# EAGLE design ライン_前 (EAGLE 9.6.2)

## Sheet 1 of 2

## Sheet 2 of 2
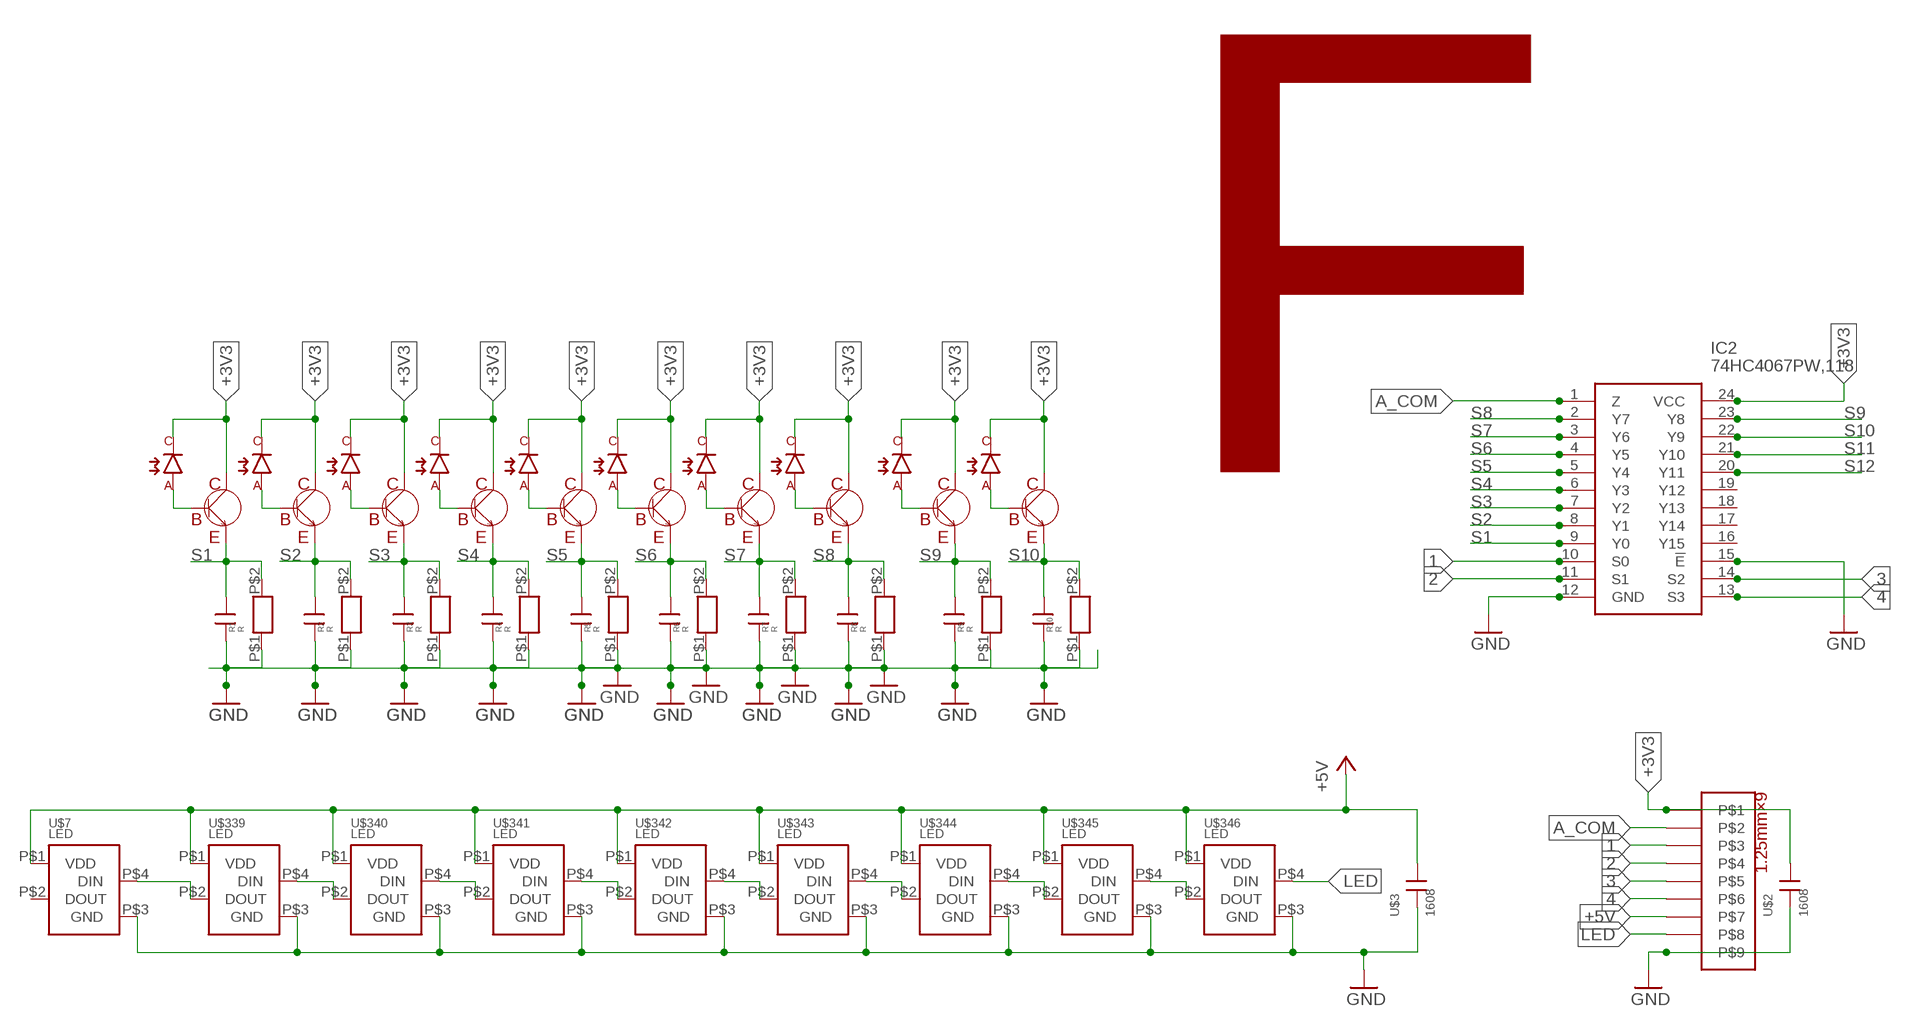
[diagram p0: schematic, sheet 2]

### Parts
C1  1608  [CON]
C2  1608  [CON]
C3  1608  [CON]
C4  1608  [CON]
C5  1608  [CON]
C6  1608  [CON]
C7  1608  [CON]
C8  1608  [CON]
C9  1608  [CON]
C10  1608  [CON]
IC2  74HC4067PW,118  [SOP65P640X110-24N]
R1  R  [1608]
R2  R  [1608]
R3  R  [1608]
R4  R  [1608]
R5  R  [1608]
R6  R  [1608]
R7  R  [1608]
R8  R  [1608]
R9  R  [1608]
R10  R  [1608]
U$1  1MMCON  [1MMCON]
U$2  1608  [CON]
U$3  1608  [CON]
U$7  LED  [LED]
U$17  2CS2712  [TRANS_SSM3J325F,LF]
U$18  フォトダイオード  [フォトダイオード]
U$19  2CS2712  [TRANS_SSM3J325F,LF]
U$20  フォトダイオード  [フォトダイオード]
U$21  2CS2712  [TRANS_SSM3J325F,LF]
U$22  フォトダイオード  [フォトダイオード]
U$23  2CS2712  [TRANS_SSM3J325F,LF]
U$24  フォトダイオード  [フォトダイオード]
U$25  2CS2712  [TRANS_SSM3J325F,LF]
U$26  フォトダイオード  [フォトダイオード]
U$27  2CS2712  [TRANS_SSM3J325F,LF]
U$28  フォトダイオード  [フォトダイオード]
U$29  2CS2712  [TRANS_SSM3J325F,LF]
U$30  フォトダイオード  [フォトダイオード]
U$31  2CS2712  [TRANS_SSM3J325F,LF]
U$32  フォトダイオード  [フォトダイオード]
U$53  2CS2712  [TRANS_SSM3J325F,LF]
U$54  フォトダイオード  [フォトダイオード]
U$55  2CS2712  [TRANS_SSM3J325F,LF]
U$56  フォトダイオード  [フォトダイオード]
U$339  LED  [LED]
U$340  LED  [LED]
U$341  LED  [LED]
U$342  LED  [LED]
U$343  LED  [LED]
U$344  LED  [LED]
U$345  LED  [LED]
U$346  LED  [LED]

### Nets
1: IC2.10(S0) U$1.P$3
2: IC2.11(S1) U$1.P$4
3: IC2.14(S2) U$1.P$5
4: IC2.13(S3) U$1.P$6
+3V3 [New Class]: IC2.24(VCC) U$1.P$1 U$2.P$1 U$17.C U$18.C U$19.C U$20.C U$21.C U$22.C U$23.C U$24.C U$25.C U$26.C U$27.C U$28.C U$29.C U$30.C U$31.C U$32.C U$53.C U$54.C U$55.C U$56.C
+5V [New Class]: U$1.P$7 U$3.P$1 U$7.P$1(VDD) U$339.P$1(VDD) U$340.P$1(VDD) U$341.P$1(VDD) U$342.P$1(VDD) U$343.P$1(VDD) U$344.P$1(VDD) U$345.P$1(VDD) U$346.P$1(VDD)
A_COM: IC2.1(Z) U$1.P$2
GND [New Class]: C1.P$2 C2.P$2 C3.P$2 C4.P$2 C5.P$2 C6.P$2 C7.P$2 C8.P$2 C9.P$2 C10.P$2 IC2.12(GND) IC2.15(!E) R1.P$1 R2.P$1 R3.P$1 R4.P$1 R5.P$1 R6.P$1 R7.P$1 R8.P$1 R9.P$1 R10.P$1 U$1.P$9 U$2.P$2 U$3.P$2 U$7.P$3(GND) U$339.P$3(GND) U$340.P$3(GND) U$341.P$3(GND) U$342.P$3(GND) U$343.P$3(GND) U$344.P$3(GND) U$345.P$3(GND) U$346.P$3(GND)
LED: U$1.P$8 U$346.P$4(DIN)
N$5: U$7.P$4(DIN) U$339.P$2(DOUT)
N$16: U$17.B U$18.A
N$17: U$19.B U$20.A
N$18: U$21.B U$22.A
N$19: U$23.B U$24.A
N$20: U$25.B U$26.A
N$21: U$27.B U$28.A
N$22: U$29.B U$30.A
N$33: U$31.B U$32.A
N$34: U$53.B U$54.A
N$35: U$55.B U$56.A
N$139: U$339.P$4(DIN) U$340.P$2(DOUT)
N$140: U$340.P$4(DIN) U$341.P$2(DOUT)
N$141: U$343.P$4(DIN) U$344.P$2(DOUT)
N$142: U$344.P$4(DIN) U$345.P$2(DOUT)
N$143: U$345.P$4(DIN) U$346.P$2(DOUT)
N$144: U$341.P$4(DIN) U$342.P$2(DOUT)
N$145: U$342.P$4(DIN) U$343.P$2(DOUT)
S1: C1.P$1 IC2.9(Y0) R1.P$2 U$17.E
S2: C2.P$1 IC2.8(Y1) R2.P$2 U$19.E
S3: C3.P$1 IC2.7(Y2) R3.P$2 U$21.E
S4: C4.P$1 IC2.6(Y3) R4.P$2 U$23.E
S5: C5.P$1 IC2.5(Y4) R5.P$2 U$25.E
S6: C6.P$1 IC2.4(Y5) R6.P$2 U$27.E
S7: C7.P$1 IC2.3(Y6) R7.P$2 U$29.E
S8: C8.P$1 IC2.2(Y7) R8.P$2 U$31.E
S9: C9.P$1 IC2.23(Y8) R9.P$2 U$53.E
S10: C10.P$1 IC2.22(Y9) R10.P$2 U$55.E
S11: IC2.21(Y10)
S12: IC2.20(Y11)
Unconnected: IC2.16(Y15) IC2.17(Y14) IC2.18(Y13) IC2.19(Y12) U$7.P$2(DOUT)

### Notes on the sheet
- F

## Library data of the parts
C1-C10 U$2 U$3 = con1608:1608
IC2 = 16ch MUX:74HC4067PW,118: 74HC(T)4067 - 16-channel analog multiplexer/demultiplexer@en-us Source: Datasheet <https://assets.nexperia.com/documents/data-sheet/74HC_HCT4067.pdf>; DESCRIPTION: 74HC(T)4067 - 16-channel analog multiplexer/demultiplexer@en-us; HEIGHT: 1.1mm; MANUFACTURER_NAME: Nexperia; MANUFACTURER_PART_NUMBER: 74HC4067PW,118; MOUSER_PART_NUMBER: 771-74HC4067PW-T; MOUSER_PRICE-STOCK: https://www.mouser.co.uk/ProductDetail/Nexperia/74HC4067PW118?qs=P62ublwmbi9BArRi%252BuDUjA%3D%3D
R1-R10 = R 1608:R
U$1 = 9P_1.25mmCON:1MMCON
U$7 U$339-U$346 = フルカラーLED:LED
U$17 U$19 U$21 U$23 U$25 U$27 U$29 U$31 U$53 U$55 = 2CS2712:2CS2712
U$18 U$20 U$22 U$24 U$26 U$28 U$30 U$32 U$54 U$56 = フォトダイオード:フォトダイオード

## Net classes
1 New Class: width 0.254 mm

## Board
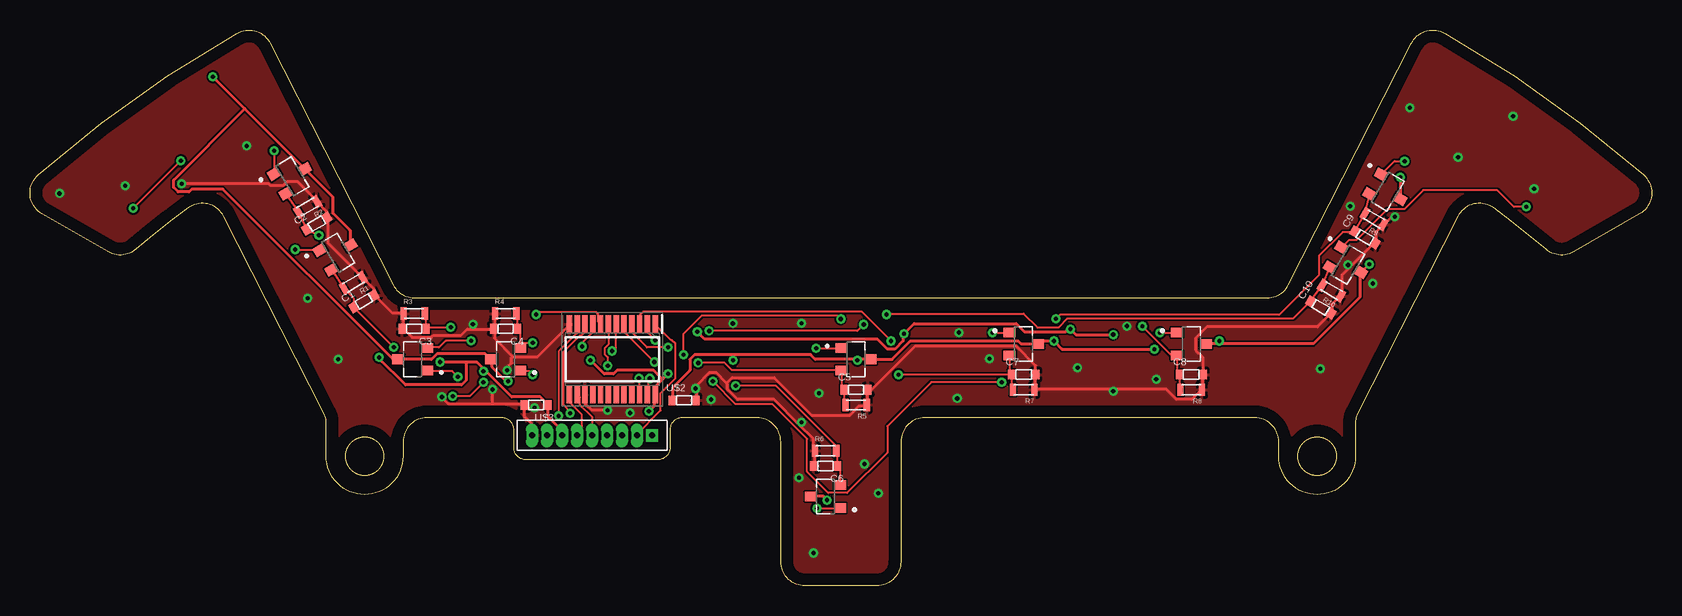
[diagram p1: board, top side]
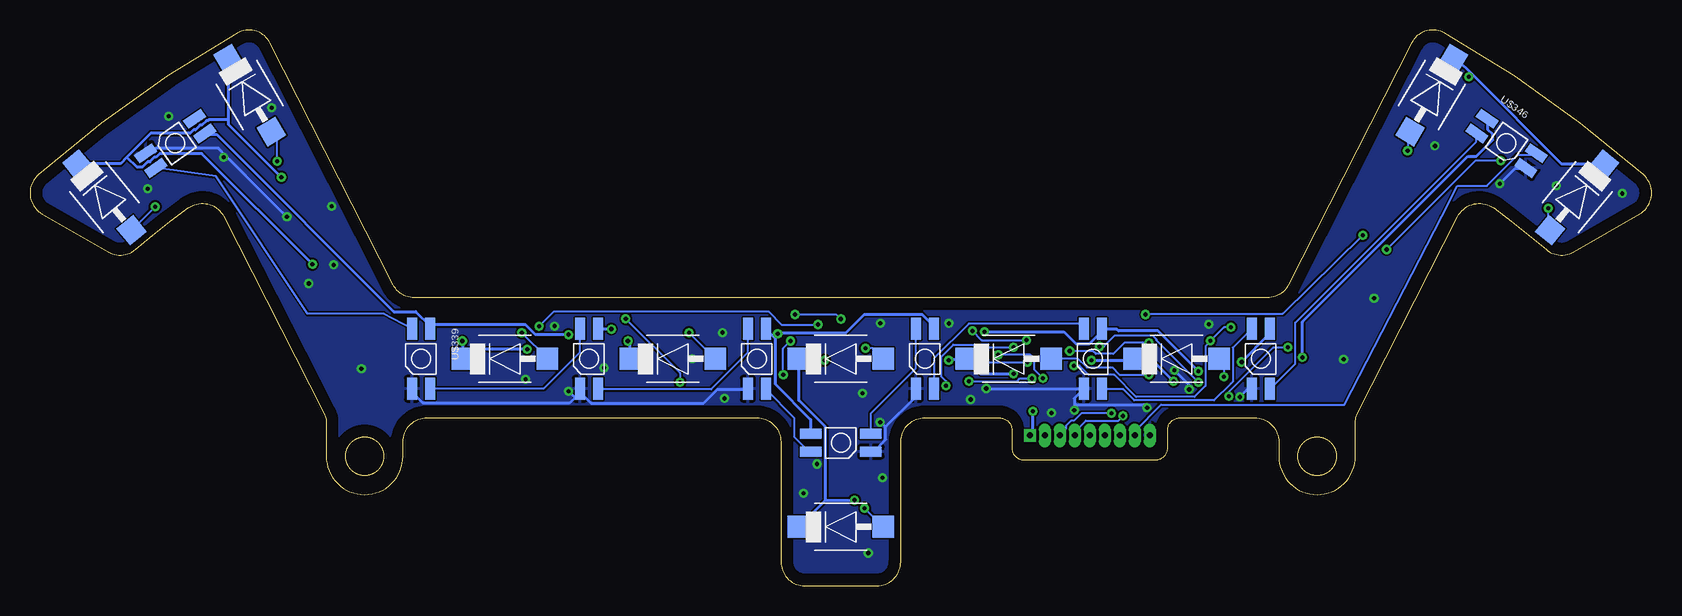
[diagram p2: board, bottom side, seen from below]

Size 135.18 x 46.32 mm. Coordinates in mm from the lower left corner, seen from the top.
Outline: 104.92,25.09 115.16,45.22 arc-93 117.93,46.05 arc-12 134.5,34.24 arc-109 134.18,31.01 128.67,27.83 arc-70 126.39,28.02 arc4 122,31.48 arc100 119.03,30.78 110.67,14.34 arc27 110.49,13.62 110.49,10.8 arc-180 104.09,10.8 104.09,12 arc90 102.09,14 74.59,14 arc90 72.59,12 72.59,2 arc-90 70.59,0 64.59,0 arc-90 62.59,2 62.59,12 arc90 60.59,14 54.34,14 arc90 53.34,13 53.34,11.5 arc-90 52.34,10.5 41.34,10.5 arc-90 40.34,11.5 40.34,13 arc90 39.34,14 33.09,14 arc90 31.09,12 31.09,10.8 arc-180 24.69,10.8 24.69,13.62 arc27 24.52,14.34 16.15,30.78 arc100 13.18,31.48 arc4 8.79,28.02 arc-70 6.51,27.83 1,31.01 arc-109 0.68,34.24 arc-12 17.25,46.05 arc-93 20.03,45.22 30.27,25.09 arc63 32.05,24 103.13,24 arc63 104.92,25.09
Outline: circle at 27.89,10.8 radius 1.6
Outline: circle at 107.29,10.8 radius 1.6
Copper layers (1*16): Top 0.035mm / dielectric 1.5mm / Bottom 0.035mm
Design rules "default": minimum track width 6mil, minimum drill 0.35mm, track to track 6mil, track to pad 6mil, pad to pad 6mil, via to via 6mil, smd to smd 6mil, copper to edge 40mil, drill to drill 6mil, minimum pad ring 10mil, minimum via ring 8mil, stop-mask expansion 4mil, vias tented up to drill 0mil, thermal gap 10mil

### Footprints (pad centres in the part's own frame; a part is rotated, then mirrored left to right if it is on the bottom)
CON = smd 0.6 x 0.813: P$1 -1,0; P$2 1,0
SOP65P640X110-24N = smd 1.475 x 0.45: 1 -2.938,3.575; 2 -2.938,2.925; 3 -2.938,2.275; 4 -2.938,1.625; 5 -2.938,0.975; 6 -2.938,0.325; 7 -2.938,-0.325; 8 -2.938,-0.975; 9 -2.938,-1.625; 10 -2.938,-2.275; 11 -2.938,-2.925; 12 -2.938,-3.575; 13 2.938,-3.575; 14 2.938,-2.925; 15 2.938,-2.275; 16 2.938,-1.625; 17 2.938,-0.975; 18 2.938,-0.325; 19 2.938,0.325; 20 2.938,0.975; 21 2.938,1.625; 22 2.938,2.275; 23 2.938,2.925; 24 2.938,3.575
1608 = smd 0.508 x 1.016: P$1 -0.889,0; P$2 0.889,0
1MMCON = drill 0.5 square: P$1 0,0 | drill 0.5 long: P$2 1.25,0; P$3 2.5,0; P$4 3.75,0; P$5 5,0; P$6 6.25,0; P$7 7.5,0; P$8 8.75,0; P$9 10,0
LED = smd 1.8 x 0.82: P$1 -2.5,0.75; P$2 -2.5,-0.75; P$3 2.5,-0.75; P$4 2.5,0.75
TRANS_SSM3J325F,LF = smd 1 x 0.8: B -1.2,0.95; C 1.2,0; E -1.2,-0.95
フォトダイオード = smd 1.8 x 1.8: A -3.55,0; C 3.55,0

### Placement (x,y rotation side)
C1  27.84,23.7 30.7 top
C2  23.9,30.18 30.7 top
C3  32.03,21.42 180 top
C4  39.65,21.42 180 top
C5  68.86,16.34 0 top
C6  66.32,9.99 180 top
C7  82.83,17.61 0 top
C8  96.8,17.61 0 top
C9  111.28,29.04 329.3 top
C10  107.6,23.2 329.3 top
IC2  48.54,18.88 270 top
R1  26.95,25.23 210.7 top
R2  23.14,31.58 210.7 top
R3  32.03,22.69 0 top
R4  39.65,22.69 0 top
R5  68.86,15.07 180 top
R6  66.32,11.26 0 top
R7  82.83,16.34 180 top
R8  96.8,16.34 180 top
R9  112.04,30.56 149.3 top
R10  108.49,24.59 149.3 top
U$1  51.84,12.53 180 top
U$2  54.51,15.45 0 top
U$3  42.19,15.07 180 top
U$7  123.08,36.87 215.1 bottom
U$17  25.68,27.77 30.7 top
U$18  6.21,32.38 50.5 bottom
U$19  21.87,34.12 30.7 top
U$20  18.32,40.89 59.3 bottom
U$21  31.89,18.88 180 top
U$22  39.59,18.92 180 bottom
U$23  39.65,18.88 180 top
U$24  53.59,18.92 180 bottom
U$25  68.86,18.88 0 top
U$26  67.59,18.92 180 bottom
U$27  66.32,7.45 180 top
U$28  67.59,4.92 180 bottom
U$29  82.83,20.15 0 top
U$30  81.59,18.92 180 bottom
U$31  96.8,20.15 0 top
U$32  95.59,18.92 180 bottom
U$53  113.18,32.85 329.3 top
U$54  116.86,40.89 120.7 bottom
U$55  109.88,26.75 329.3 top
U$56  128.97,32.38 129.5 bottom
U$339  102.59,18.92 270 bottom
U$340  88.59,18.92 270 bottom
U$341  74.59,18.92 270 bottom
U$342  67.59,11.92 0 bottom
U$343  60.59,18.92 270 bottom
U$344  46.59,18.92 270 bottom
U$345  32.59,18.92 270 bottom
U$346  12.1,36.87 324.9 bottom

### Tracks (layer width: path | path; a pad name or v marks a point on that pad's centre or on a via)
1  (via drill 0.35)
  Top 0.152: v45.03,14.38 45.03,14.51 44.43,15.12 44.43,19.46 45.81,20.85 45.94,20.85 46.25,21.17 46.27,21.18 IC2.10
  Bottom 0.152: U$1.P$3 49.38,12.55 48.83,13.11 48.83,13.33 48.4,13.76 48.15,13.76 47.53,14.38 v45.03,14.38
2  (via drill 0.35)
  Top 0.152: v44.07,14.15 44.12,14.2 44.12,19.59 45.57,21.04 45.57,21.77 IC2.11
  Bottom 0.152: v44.07,14.15 44.45,13.77 47.17,13.77 48.08,12.86 48.08,12.55 U$1.P$4
3
  Top 0.152: IC2.14 45.81,15.74 45.81,15.11 46.84,14.08 U$1.P$5
4
  Top 0.152: IC2.13 45.04,15.87 45.04,15.23 45.97,14.3 45.97,12.91 U$1.P$6
+3V3  (via drill 0.35)
  Top 0.254: U$17.C 26.67,28.4 26.67,29.62 25.22,31.07 25.22,32.44 22.94,34.73 U$19.C 22.86,34.8 17.91,39.76 | v15.24,42.42 17.91,39.76 | v114.23,34.04 114.23,32.29 U$53.C | U$27.C 66.14,7.45 v66.45,7.14 | 99.14,20.17 106.99,20.17 110.87,24.06 110.87,26.12 U$55.C 111.03,26.19 v111.64,26.8 | 99.14,20.17 98.07,20.17 U$31.C | 99.14,20.17 v99.14,20.4 | v39.85,17.05 39.7,17.05 38.48,18.27 38.48,18.8 U$23.C 38.41,18.88 37.95,19.33 33.92,19.33 33.47,18.88 U$21.C 30.25,18.88 16.08,33.05 13.49,33.05 13.26,32.82 12.35,32.82 11.97,33.2 11.97,33.81 17.91,39.76 | v51.59,14.53 52.05,14.99 52.05,15.91 IC2.24 52.12,16.06 52.12,16.59 52.73,17.2 | 58.6,19.26 65.08,19.26 65.46,18.88 68.96,18.88 | 58.6,19.26 55.4,19.26 55.02,18.88 55.02,17.96 53.57,16.52 53.57,15.45 U$2.P$1 | 68.96,18.88 U$25.C 71.86,18.88 73.38,20.4 82.37,20.4 82.6,20.17 83.97,20.17 U$29.C 84.13,20.17 84.36,20.4 v85.35,20.4 86.03,19.72 v93.73,19.72 | 58.6,19.26 v58.6,18.8 | v53.19,17.66 52.73,17.2 | v46.71,18.8 47.86,17.66 48.64,17.66 48.95,17.96 51.97,17.96 52.73,17.2 | v68.96,18.8 68.96,18.88
  Bottom 0.254: 15.01,42.65 16.23,43.87 16.46,43.87 U$20.C | 15.01,42.65 7.55,35.18 3.96,35.18 U$18.C | 15.01,42.65 v15.24,42.42 | v114.23,34.04 118.65,38.46 118.65,38.84 | 118.65,38.84 118.65,43.87 U$54.C | 127.1,35.72 125.12,37.7 121.85,37.7 121.54,38 121.39,38 121.01,38.38 120.86,38.38 120.47,38.77 120.32,38.77 120.25,38.84 118.65,38.84 | 127.1,35.72 127.64,35.18 131.22,35.18 U$56.C | 68.89,7.14 v66.45,7.14 | 68.89,7.14 71.1,4.93 U$28.C | 68.89,7.14 68.89,13.24 71.1,15.45 71.1,18.88 U$26.C 71.02,18.8 v68.96,18.8 | v99.14,20.4 99.14,18.95 U$32.C 99.06,19.72 v93.73,19.72 | v39.85,17.05 41.68,18.88 43.13,18.88 U$22.C 43.21,18.8 v46.71,18.8 | v51.59,14.53 51.59,12.78 U$1.P$1 | v58.6,18.8 58.52,18.88 57.15,18.88 U$24.C 57.08,18.8 55.93,17.66 v53.19,17.66 | v85.35,20.4 85.19,20.25 85.19,18.95 U$30.C | 127.1,35.72 126.27,34.88 125.81,34.88 125.35,35.34 125.2,35.34 124.82,35.72 124.67,35.72 124.36,36.02 120.86,36.02 v111.64,26.8
+5V  (via drill 0.35)
  Top 0.254: U$1.P$7 44.27,12.55 44.27,13.01 43.21,14.08 43.21,15.07 U$3.P$1 43.13,15.14 42.52,15.75 40.16,15.75 37.87,18.04 | 36.35,18.65 37.26,18.65 37.87,18.04 | 36.35,18.65 v34.19,18.65 | v37.8,17.89 37.8,17.96 37.87,18.04 | v29.11,19.03 29.11,18.94 31.31,16.74 35.97,16.74 36.35,17.12 36.35,18.65 | v90.3,20.93 87.17,20.93 v86.72,21.39 86.54,21.39 86.34,21.19 82.88,21.19 82.22,21.85 73.69,21.85 v72.85,21.01 72.77,20.93 72.77,20.4 72.09,19.72 71.48,19.72 70.64,20.55 56.24,20.55 v55.63,21.16
  Bottom 0.254: v34.19,18.65 31.85,20.99 31.85,21.39 U$345.P$1 | v37.8,17.89 41.15,21.24 44.43,21.24 44.58,21.39 45.8,21.39 U$344.P$1 45.87,21.32 45.87,21.16 46.87,20.17 48.01,20.17 49,21.16 v55.63,21.16 | v29.11,19.03 29.11,22 15.32,35.79 14.63,35.79 13.26,37.17 13.26,37.62 13.64,38 13.64,38.92 U$346.P$1 | U$7.P$1 120.55,37.62 119.64,37.62 104.85,22.84 103.02,22.84 101.88,21.7 101.88,21.47 U$339.P$1 101.81,21.77 93.88,21.77 93.04,20.93 v90.3,20.93 | 73.08,20.63 73.08,16.82 70.11,13.85 70.11,12.71 U$342.P$1 | 73.08,20.63 73.84,21.39 U$341.P$1 | 73.08,20.63 72.77,20.93 | 72.77,20.93 72.62,21.09 67.16,21.09 65.64,22.61 60.81,22.61 59.9,21.7 59.9,21.47 U$343.P$1 | v86.72,21.39 87.78,21.39 U$340.P$1 | v72.85,21.01 72.77,20.93
A_COM
  Top 0.152: IC2.1 52.12,21.77 53.42,20.48 53.49,20.48 53.8,20.17 53.8,17.28 52.58,16.06 52.58,14.61 50.52,12.55 U$1.P$2
GND  (via drill 0.35)
  Top 0.254: C4.P$2 38.71,21.47 38.71,22.69 R4.P$1 | C4.P$2 38.56,21.39 36.45,21.39 35.92,20.86 33.61,20.86 33.45,20.71 31.85,20.71 31.17,21.39 C3.P$2 31.09,21.47 31.09,22.69 R3.P$1 31.02,22.76 30.18,22.76 28.81,24.14 C1.P$2 28.65,24.29 28.65,24.74 27.74,25.66 R1.P$1 27.66,25.74 24.84,28.55 24.84,30.61 C2.P$2 24.69,30.76 24.69,31.22 23.93,31.98 R2.P$1 23.85,32.14 22.33,33.66 21.41,33.66 21.11,33.36 20.04,33.36 19.89,33.51 v12.65,33.51 | 40.24,19.11 42.29,19.11 44.96,21.77 IC2.12 | 40.24,19.11 38.71,20.63 38.71,21.32 C4.P$2 | v48.14,14.64 46.84,14.64 46.33,15.14 46.33,15.91 IC2.15 | U$3.P$2 41.23,15.07 41.23,14.08 41.84,13.47 41.84,12.55 U$1.P$9 | v34.33,15.74 34.33,15.72 34.9,15.14 38.56,15.14 | 38.56,15.14 41.15,15.14 U$3.P$2 | v42.06,14.84 41.3,14.84 U$3.P$2 | C6.P$2 65.38,10.04 65.38,11.26 R6.P$1 65.31,11.33 65.31,12.25 64.12,13.43 | 55.55,16.44 55.55,16.67 56.62,17.73 57.23,17.73 58.07,16.9 | 55.55,16.44 55.55,15.45 U$2.P$2 | 58.07,16.9 58.14,16.82 58.14,16.36 58.98,15.52 62.03,15.52 64.12,13.43 | 58.07,16.9 58.52,17.35 62.03,17.35 65.15,14.23 68.35,14.23 69.12,14.99 69.65,14.99 R5.P$1 69.8,15.07 69.8,16.29 C5.P$2 69.95,16.36 70.18,16.36 73.76,19.94 82.22,19.94 83.82,18.34 83.82,17.73 C7.P$2 83.82,17.58 83.82,16.44 R7.P$1 83.9,16.36 90.3,16.36 | 64.12,13.43 v64.31,13.62 | v55.48,16.44 55.55,16.44 | 90.3,16.36 94.72,16.36 95.56,15.52 96.85,15.52 97.61,16.29 R8.P$1 97.69,16.36 97.77,16.44 97.77,17.58 C8.P$2 97.77,17.73 97.77,19.03 97.16,19.64 97.16,20.63 98.1,21.57 107.32,21.57 108.36,22.61 C10.P$2 108.51,22.69 108.51,23.45 109.2,24.14 R10.P$1 109.35,24.21 109.35,25.89 112.02,28.55 C9.P$2 112.17,28.55 112.17,29.47 112.78,30.08 R9.P$1 112.93,30.16 113.54,30.76 v113.77,30.76
  Top 0.254: v90.3,16.21 90.3,16.36 | v39.78,17.96 39.78,18.19 40.16,18.57 40.16,19.03 40.24,19.11 | 38.56,15.14 v38.56,16.36
  Bottom 0.254: v12.65,33.51 11.36,34.8 10.52,34.8 U$346.P$3 | v34.33,15.74 33.71,16.36 33.38,16.36 U$345.P$3 | v42.06,14.84 42.32,15.09 47.98,15.09 v48.14,14.64 48.14,15.62 U$344.P$3 47.4,16.44 v55.48,16.44 | 63.86,13.24 61.34,15.75 61.34,16.36 U$343.P$3 | 63.86,13.24 63.86,12.17 64.85,11.18 65.08,11.18 U$342.P$3 | 63.86,13.24 64.24,13.62 v64.31,13.62 | U$341.P$3 75.36,16.36 77.88,16.36 79.02,15.22 88.39,15.22 89.31,16.13 89.31,16.36 U$340.P$3 89.38,16.06 89.77,15.68 | 89.77,15.68 90.22,15.22 102.41,15.22 103.33,16.13 103.33,16.36 U$339.P$3 | v113.77,30.76 119.48,36.48 124.67,36.48 125.05,36.1 125.5,36.1 U$7.P$3 | v90.3,16.21 89.77,15.68 | v39.78,17.96 38.56,16.74 v38.56,16.36
  other vias: 25.68,18.88 23.14,23.96 18.06,36.66 2.47,32.7 7.94,33.33 36.92,21.79 50.03,14.41 56.77,15.52 65.78,16.05 58.59,21.86 64.3,21.89 77.45,21.1 79.99,18.92 77.29,15.61 64.11,9.01 69.57,10.15 70.72,7.71 65.31,2.74 91.44,21.65 93.88,17.21 87.33,18.18 107.56,18.09 111.94,25.19 119.04,35.71 109.87,26.74 123.62,39.13 125.38,33.08 115.03,39.83 110.05,31.64
  pour Top: -0.99,46.82 -0.99,-2.71 141.25,-2.71 141.25,48.09 -0.99,48.09
  pour Bottom: -0.99,48.09 -0.99,-2.71 141.25,-2.71 141.25,48.09
LED
  Bottom 0.152: U$1.P$8 43.09,12.9 40.9,15.09 25.64,15.09 17.51,30.78 16.19,33.33 13.74,33.33 11.15,35.91 9.76,35.91 U$346.P$4
N$5
  Bottom 0.152: U$339.P$2 105.69,22.69 112.04,22.69 119.66,34.12 U$7.P$4
N$16  (via drill 0.35)
  Top 0.152: v22.1,28.02 24.16,28.02 U$17.B | v8.61,31.45 v12.58,35.41
  Bottom 0.152: v22.1,28.02 14.71,35.41 v12.58,35.41 | v8.61,31.45 8.61,29.77 8.54,29.7 U$18.A
N$17  (via drill 0.35)
  Top 0.152: v20.35,36.25 20.35,34.35 U$19.B
  Bottom 0.152: v20.35,36.25 20.35,37.62 20.2,37.78 U$20.A
N$18  (via drill 0.35)
  Top 0.152: v35.66,17.43 35.21,17.89 33.16,17.89 U$21.B
  Bottom 0.152: v35.66,17.43 35.66,18.57 35.97,18.88 U$22.A
N$19  (via drill 0.35)
  Top 0.152: v41.91,17.58 41.61,17.89 40.92,17.89 U$23.B
  Bottom 0.152: v41.91,17.58 44.35,17.58 44.96,18.19 47.09,18.19 47.86,18.95 49.99,18.95 U$24.A
N$20  (via drill 0.35)
  Top 0.152: v65.53,19.79 67.59,19.79 U$25.B
  Bottom 0.152: v65.53,19.79 64.92,19.79 64.09,18.95 U$26.A
N$21  (via drill 0.35)
  Top 0.152: v65.61,6.46 67.52,6.46 U$27.B
  Bottom 0.152: v65.61,6.46 64.09,4.93 U$28.A
N$22  (via drill 0.35)
  Top 0.152: v80.24,21.09 81.61,21.09 U$29.B
  Bottom 0.152: v80.24,21.09 78.11,18.95 U$30.A
N$33  (via drill 0.35)
  Top 0.152: v94.19,21.09 95.56,21.09 U$31.B
  Bottom 0.152: v94.19,21.09 92.05,18.95 U$32.A
N$34  (via drill 0.35)
  Top 0.152: U$53.B 113.75,35.39 v114.58,35.39
  Bottom 0.152: v114.58,35.39 114.58,37.38 U$54.A
N$35  (via drill 0.35)
  Top 0.152: v124.74,31.58 123.7,31.58 122.3,32.98 116.13,32.98 114.54,31.39 113.16,31.39 110.57,28.8 109.96,28.8 U$55.B
  Bottom 0.152: U$56.A v124.74,31.58
N$139
  Bottom 0.152: U$339.P$4 101.81,16.44 92.36,16.44 89.38,19.41 89.38,21.39 U$340.P$2
N$140
  Bottom 0.152: U$340.P$4 87.78,16.36 78.41,16.36 75.36,19.41 75.36,21.39 U$341.P$2
N$141
  Bottom 0.152: U$343.P$4 59.82,16.44 59.82,18.95 56.92,21.85 47.78,21.85 47.4,21.47 U$344.P$2
N$142
  Bottom 0.152: U$344.P$4 45.8,16.36 44.05,16.36 43.13,15.45 36.48,15.45 35.08,16.85 34.91,17.01 34.91,19.85 U$345.P$2 33.3,21.47
N$143
  Bottom 0.152: U$346.P$2 14.63,37.62 14.63,37.01 29.72,21.93 29.72,18.5 31.78,16.44 U$345.P$4
N$144
  Bottom 0.152: U$342.P$2 70.11,11.18 70.26,11.18 71.48,12.4 71.48,14 73.84,16.36 U$341.P$4
N$145
  Bottom 0.152: U$343.P$2 61.34,21.39 61.34,18.12 65.08,14.38 65.08,12.71 U$342.P$4
S1  (via drill 0.35)
  Top 0.152: U$17.E R1.P$2 26.21,24.74 26.98,23.98 26.98,23.22 C1.P$1 27.05,23.14 v30.33,19.87 | v35.24,15.8 36.63,15.8 v37.8,16.97 | v46.03,19.94 46.03,20.25 46.87,21.09 46.87,21.77 IC2.9
  Bottom 0.152: v30.33,19.87 31.55,19.87 35.24,16.17 v35.24,15.8 | v37.8,16.97 41.3,20.48 41.3,20.55 41.61,20.86 44.73,20.86 45.65,19.94 v46.03,19.94
S2  (via drill 0.35)
  Top 0.152: U$19.E R2.P$2 C2.P$1 v24.08,29.2 | IC2.8 47.37,22.01 47.37,22.65 47.24,22.78 42.37,22.78 v42.19,22.61
  Bottom 0.152: v42.19,22.61 42.11,22.69 30.76,22.69 v24.08,29.2
S3  (via drill 0.35)
  Top 0.152: 33,21.54 33,22.61 R3.P$2 | 33,21.54 33,21.47 C3.P$1 33,21.54 | v36.78,20.41 34.65,20.41 34.1,19.87 33.16,19.87 U$21.E | 33,21.54 v35.08,21.54 | IC2.7 48.22,20.12 47.91,19.81 47.91,19.31 48.16,19.06 v48.16,18.34
  Bottom 0.152: v35.08,21.54 35.65,21.54 v36.78,20.41 36.78,20.35 37.19,19.94 37.19,16.67 38.1,15.75 42.98,15.75 44.81,17.58 46.94,17.58 47.7,18.34 v48.16,18.34
S4  (via drill 0.35)
  Top 0.152: R4.P$2 40.62,22.61 40.62,21.47 C4.P$1 40.69,21.39 40.85,21.24 40.85,20.25 | 40.85,20.25 40.85,19.87 U$23.E | v48.52,19.56 48.58,19.5 48.85,19.77 48.85,21.77 IC2.6 | 40.85,20.25 v41.91,20.25
  Bottom 0.152: v48.52,19.56 46.56,19.56 46.33,19.33 44.88,19.33 43.97,20.25 v41.91,20.25
S5  (via drill 0.35)
  Top 0.152: R5.P$2 67.9,15.14 67.9,16.29 C5.P$1 67.82,16.36 67.67,16.52 67.67,17.89 U$25.E 67.59,17.96 58.52,17.96 57.91,18.57 v55.7,18.57 | v52.05,18.65 49.53,21.16 49.53,21.77 IC2.5
  Bottom 0.152: v52.05,18.65 55.63,18.65 v55.7,18.57
S6  (via drill 0.35)
  Top 0.152: U$27.E 67.52,8.44 67.52,9.81 67.36,9.96 C6.P$1 67.29,10.04 67.29,11.18 R6.P$2 67.21,11.64 62.18,16.67 v58.83,16.67 | v53.19,19.87 51.44,19.87 50.22,21.09 50.22,21.77 IC2.4
  Bottom 0.152: v53.19,19.87 55.93,19.87 56.16,20.1 58.22,20.1 59.21,19.11 59.21,17.43 58.83,17.05 v58.83,16.67
S7  (via drill 0.35)
  Top 0.152: R7.P$2 81.84,16.44 81.84,17.58 C7.P$1 | U$29.E 81.69,19.18 81.69,17.73 81.76,17.66 C7.P$1 | v71.78,20.4 69.34,22.84 51.13,22.84 50.83,22.54 50.83,21.85 IC2.3 | v72.39,17.58 81.76,17.58 C7.P$1
  Bottom 0.152: v71.78,20.4 72.39,19.79 v72.39,17.58
S8  (via drill 0.35)
  Top 0.152: R8.P$2 95.86,16.36 95.86,17.58 C8.P$1 95.79,17.66 95.63,17.81 95.63,19.18 U$31.E 95.56,19.26 95.1,19.26 v92.74,21.62 | v52.12,20.48 51.51,21.09 51.51,21.77 IC2.2 | v56.62,21.24 68.96,21.24 v69.5,21.77
  Bottom 0.152: v52.12,20.48 55.86,20.48 v56.62,21.24 | v69.5,21.77 72.54,21.77 73.64,22.87 91.49,22.87 v92.74,21.62
S9  (via drill 0.35)
  Top 0.152: U$53.E R9.P$2 C9.P$1 110.42,29.47 109.43,29.47 107.44,27.49 107.44,25.89 104.14,22.59 85.85,22.59 v85.52,22.26 | v51.67,17.28 51.51,17.12 51.51,15.98 IC2.23 | v56.92,17.05 58.83,15.14 61.88,15.14 64.77,12.25 64.77,9.5 66.52,7.75 68.12,7.75 71.48,11.11 71.48,13.31 75.14,16.97 v81,16.97
  Bottom 0.152: v51.67,17.28 52.66,17.28 52.88,17.05 v56.92,17.05 | v85.52,22.26 81,17.73 v81,16.97
S10  (via drill 0.35)
  Top 0.152: U$55.E R10.P$2 C10.P$1 105.31,22.28 86.49,22.28 85.75,21.54 83.97,21.54 82.83,22.69 71.48,22.69 v71.4,22.61 | IC2.22 50.82,17.25 v50.76,17.31 | v54.47,19.26 54.47,21 56.01,22.54 67.29,22.54 v67.59,22.23
  Bottom 0.152: v50.76,17.31 51.44,17.99 51.44,18.9 51.8,19.26 v54.47,19.26 | v67.59,22.23 67.96,22.61 v71.4,22.61